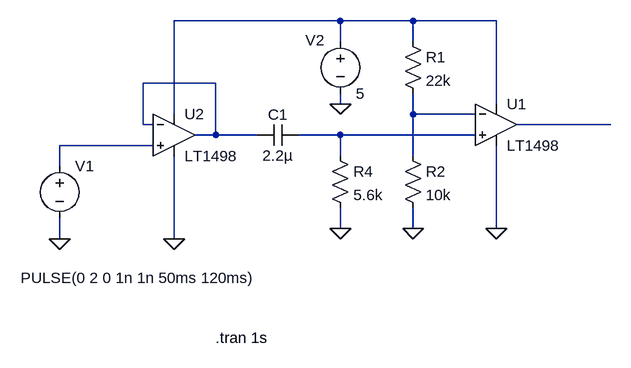
[diagram p0: schematic Pulse_shortener_(Digital).asc]
Pulse_shortener_(Digital).asc, the LTspice schematic file:
Version 4
SHEET 1 880 680
WIRE -144 -176 -400 -176
WIRE -32 -176 -144 -176
WIRE 96 -176 -32 -176
WIRE -144 -144 -144 -176
WIRE -32 -144 -32 -176
WIRE -336 -80 -448 -80
WIRE -144 -48 -144 -64
WIRE 96 -48 96 -176
WIRE -400 -32 -400 -176
WIRE -32 -32 -32 -64
WIRE 64 -32 -32 -32
WIRE -448 -16 -448 -80
WIRE -432 -16 -448 -16
WIRE 272 -16 128 -16
WIRE -336 0 -336 -80
WIRE -336 0 -368 0
WIRE -272 0 -336 0
WIRE -144 0 -208 0
WIRE 64 0 -144 0
WIRE -432 16 -576 16
WIRE -144 32 -144 0
WIRE -32 32 -32 -32
WIRE -576 48 -576 16
WIRE -144 144 -144 112
WIRE -32 144 -32 112
WIRE 96 144 96 16
WIRE -576 160 -576 128
WIRE -400 160 -400 32
FLAG -144 144 0
FLAG -32 144 0
FLAG -400 160 0
FLAG 96 144 0
FLAG -576 160 0
FLAG -144 -48 0
SYMBOL OpAmps\\LT1498 96 -80 R0
SYMATTR InstName U1
SYMBOL voltage -144 -160 R0
WINDOW 0 -54 14 Left 2
WINDOW 123 0 0 Left 0
WINDOW 39 0 0 Left 0
SYMATTR InstName V2
SYMATTR Value 5
SYMBOL res -48 -160 R0
SYMATTR InstName R1
SYMATTR Value 22k
SYMBOL res -48 16 R0
SYMATTR InstName R2
SYMATTR Value 10k
SYMBOL OpAmps\\LT1498 -400 -64 R0
SYMATTR InstName U2
SYMBOL cap -208 -16 R90
WINDOW 0 0 32 VBottom 2
WINDOW 3 32 32 VTop 2
SYMATTR InstName C1
SYMATTR Value 2.2µ
SYMBOL res -160 16 R0
SYMATTR InstName R4
SYMATTR Value 5.6k
SYMBOL voltage -576 32 R0
WINDOW 3 -60 188 Left 2
WINDOW 123 0 0 Left 0
WINDOW 39 0 0 Left 0
SYMATTR InstName V1
SYMATTR Value PULSE(0 2 0 1n 1n 50ms 120ms)
TEXT -336 312 Left 2 !.tran 1s

The netlist it stands for:
* Pulse_shortener_(Digital).asc
XU1 N005 N003 N001 0 N004 LT1498  ; pins In+ In- V+ V- OUT
V2 N001 0 5
R1 N001 N003 22k
R2 N003 0 10k
XU2 N006 N002 N001 0 N002 LT1498  ; pins In+ In- V+ V- OUT
C1 N005 N002 2.2µ
R4 N005 0 5.6k
V1 N006 0 PULSE(0 2 0 1n 1n 50ms 120ms)
.tran 1s
.lib LTC.lib
.backanno
.end